# EAGLE schematic durtest4 (EAGLE 6.0)
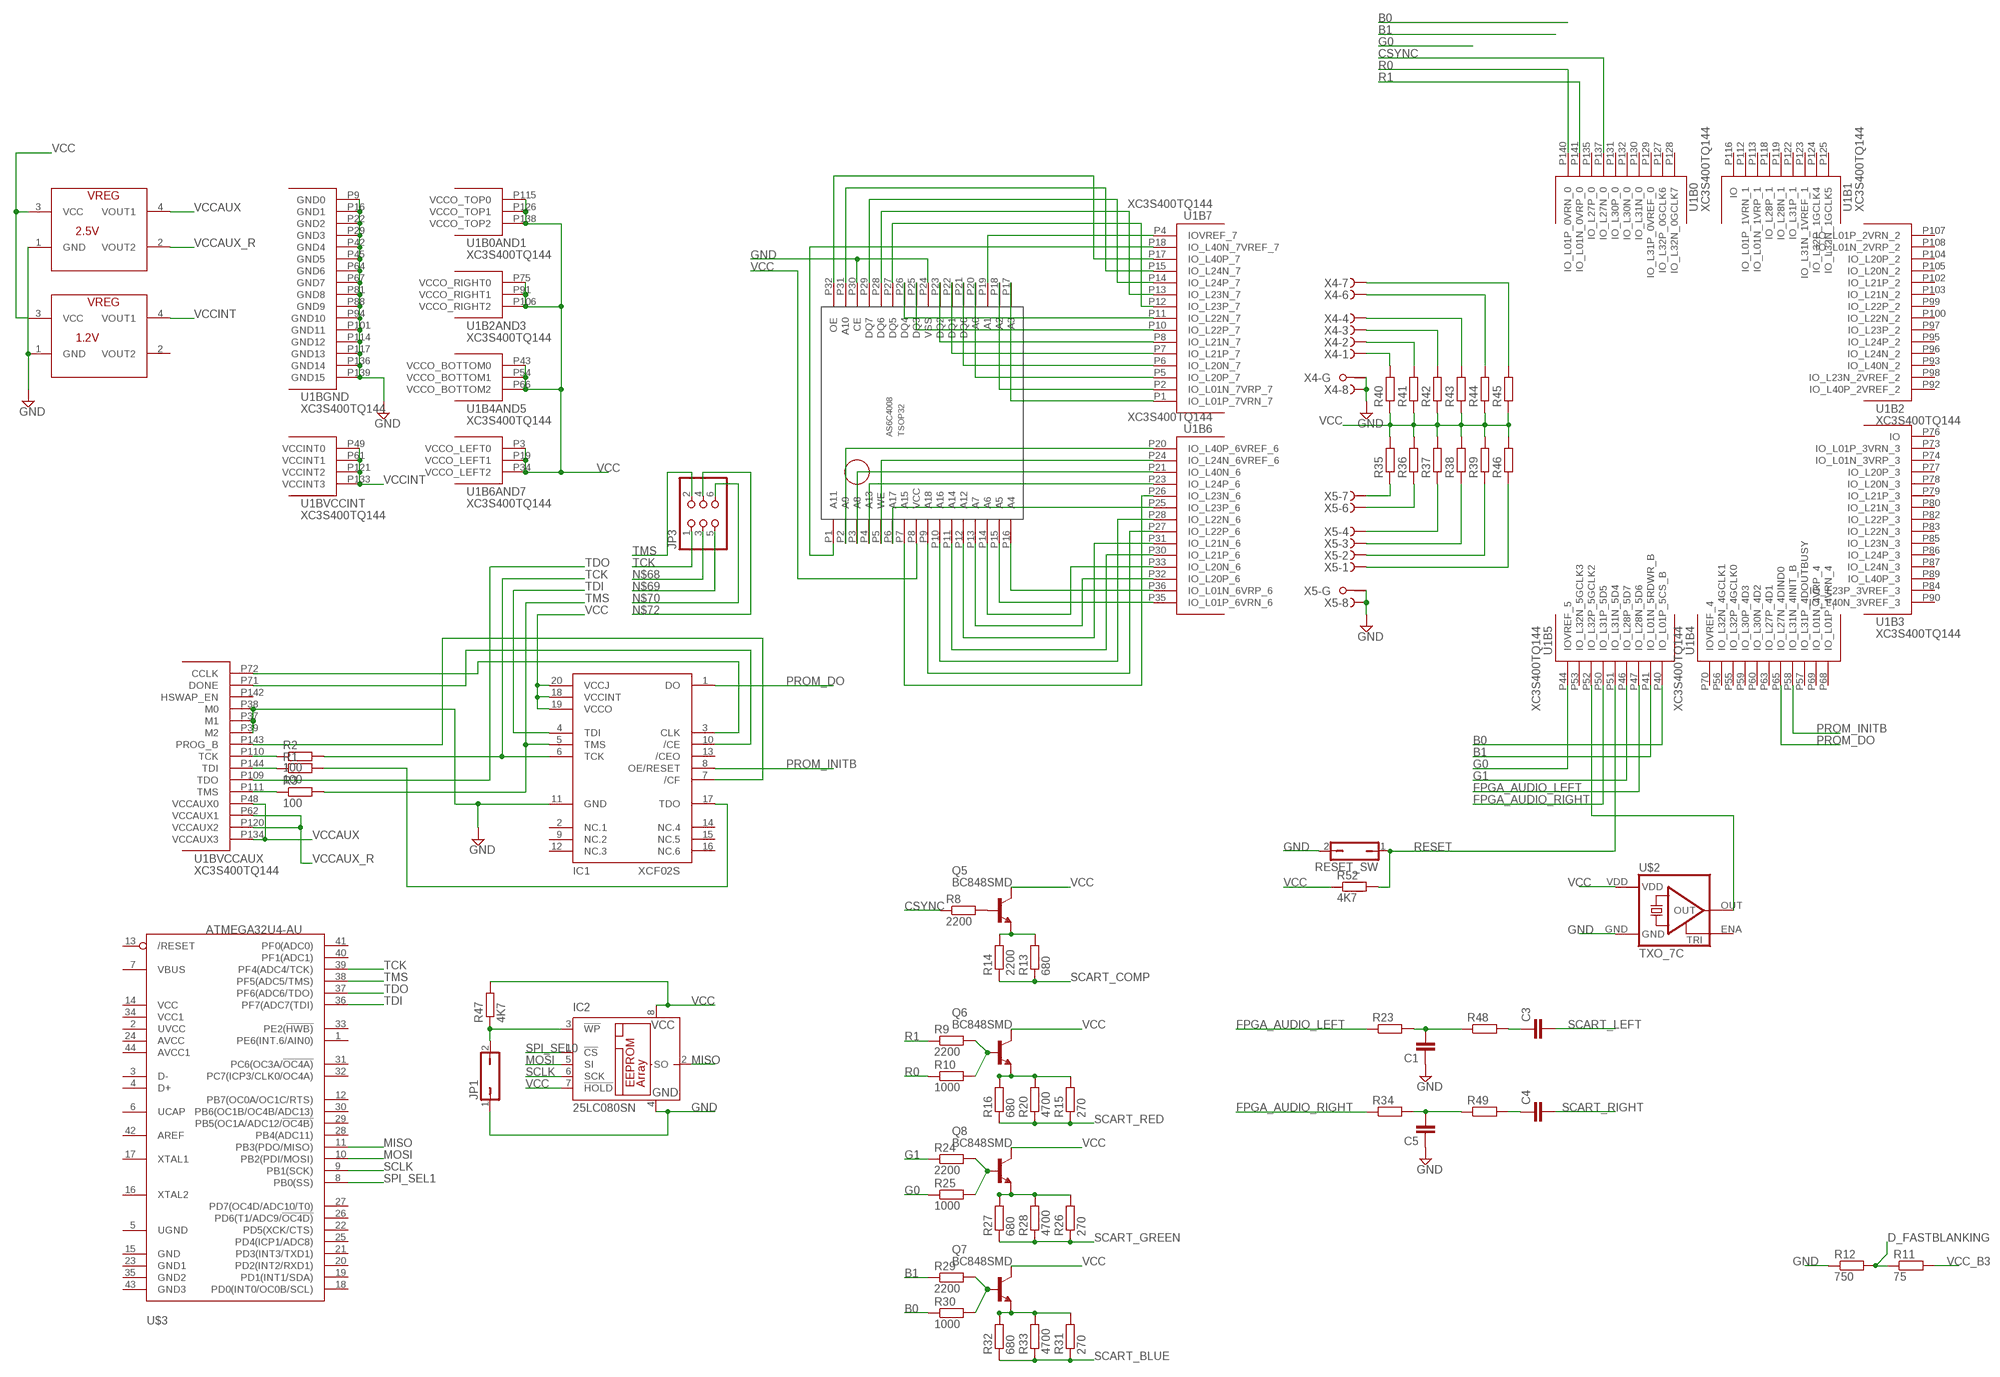
[diagram p0: schematic, sheet 1, part 1 of 2]
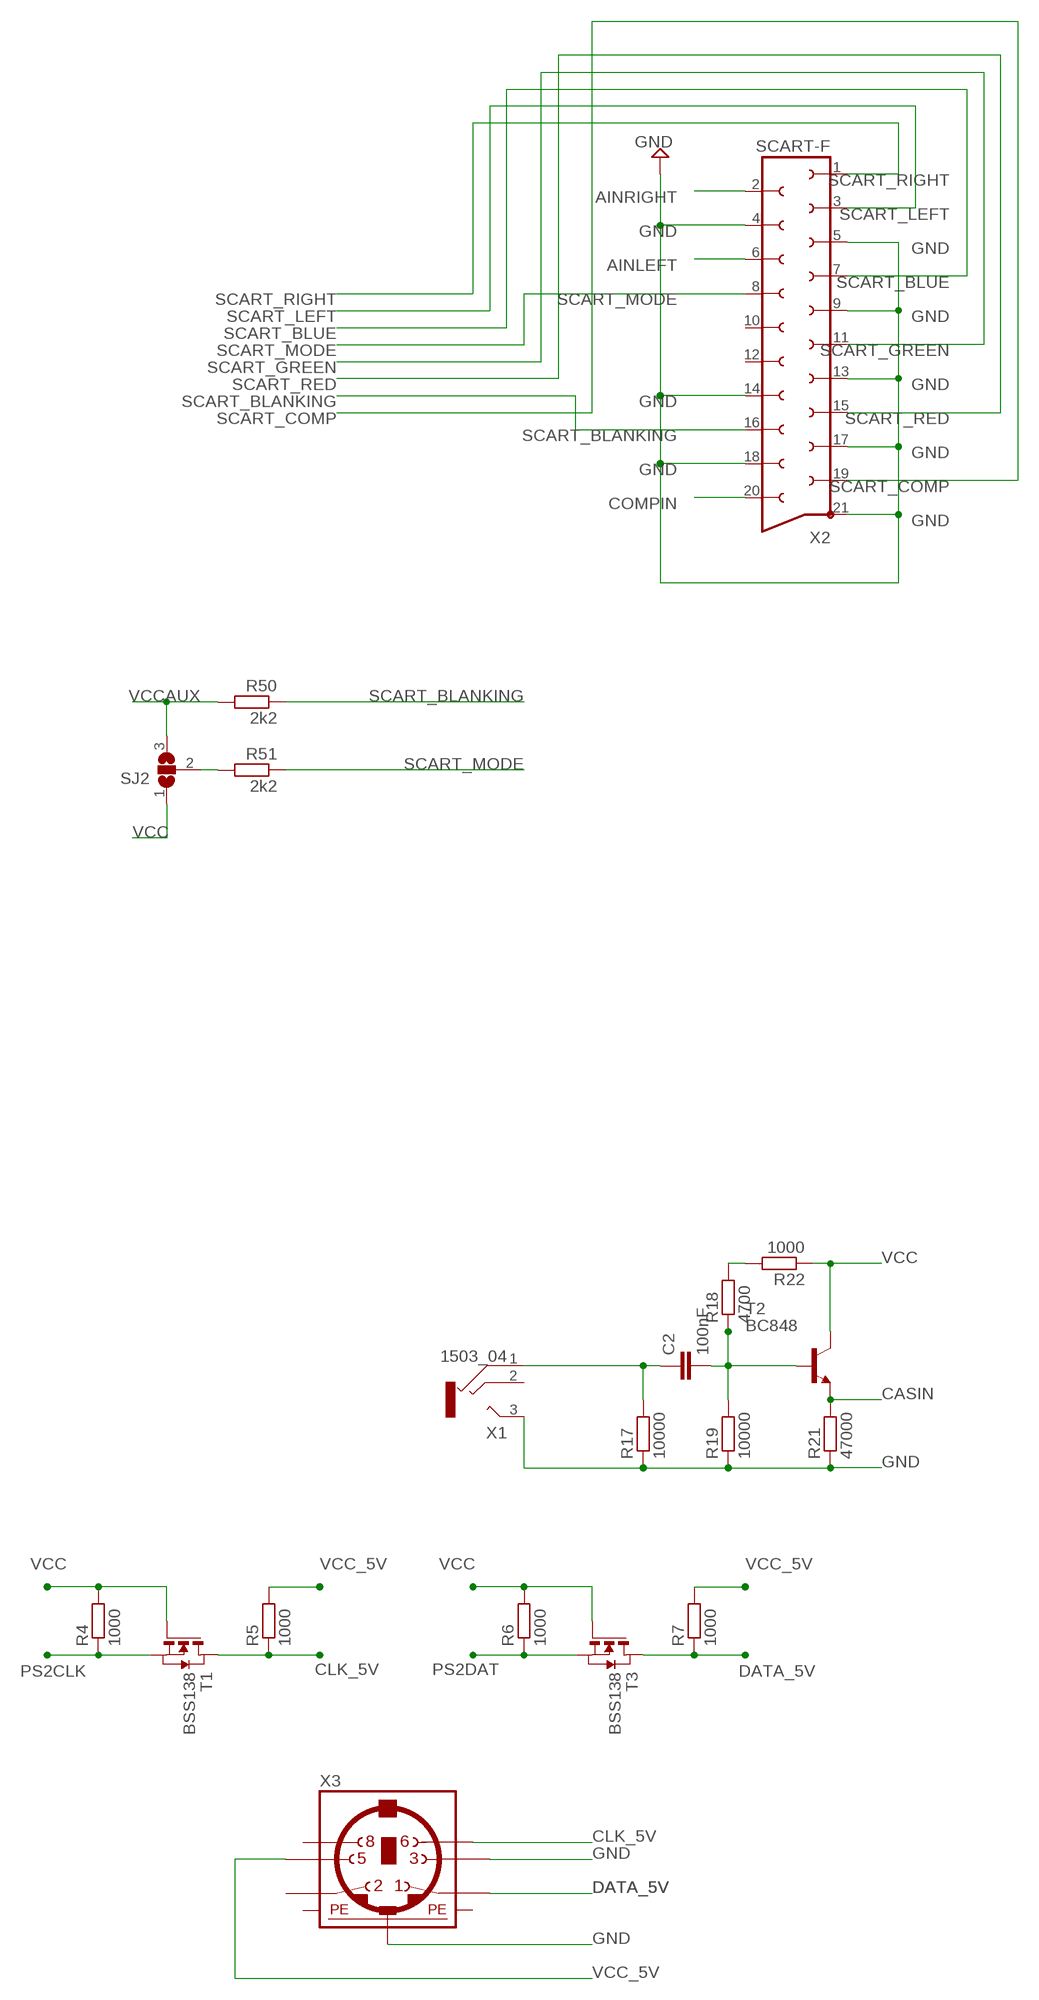
[diagram p1: schematic, sheet 1, part 2 of 2]

## Parts
C1  C-EUC0603  [C0603]
C2  100nF  C-EUC0603  [C0603]
C3  C-EUC0603  [C0603]
C4  C-EUC0603  [C0603]
C5  C-EUC0603  [C0603]
IC1  XCF02S  [VO20]
IC2  25LC080SN  [SO-08]
JP1  JP1Q  [JP1]
JP3  PINHD-2X3  [2X03]
Q5  BC848SMD  [SOT23]
Q6  BC848SMD  [SOT23]
Q7  BC848SMD  [SOT23]
Q8  BC848SMD  [SOT23]
R1  100  R-EU_R0805  [R0805]
R2  100  R-EU_R0805  [R0805]
R3  100  R-EU_R0805  [R0805]
R4  1000  R-EU_R0805  [R0805]
R5  1000  R-EU_R0805  [R0805]
R6  1000  R-EU_R0805  [R0805]
R7  1000  R-EU_R0805  [R0805]
R8  2200  R-EU_R0805  [R0805]
R9  2200  R-EU_R0805  [R0805]
R10  1000  R-EU_R0805  [R0805]
R11  75  R-EU_R0805  [R0805]
R12  750  R-EU_R0805  [R0805]
R13  680  R-EU_R0805  [R0805]
R14  2200  R-EU_R0805  [R0805]
R15  270  R-EU_R0805  [R0805]
R16  680  R-EU_R0805  [R0805]
R17  10000  R-EU_R0805  [R0805]
R18  4700  R-EU_R0805  [R0805]
R19  10000  R-EU_R0805  [R0805]
R20  4700  R-EU_R0805  [R0805]
R21  47000  R-EU_R0805  [R0805]
R22  1000  R-EU_R0805  [R0805]
R23  R-EU_M0805  [M0805]
R24  2200  R-EU_R0805  [R0805]
R25  1000  R-EU_R0805  [R0805]
R26  270  R-EU_R0805  [R0805]
R27  680  R-EU_R0805  [R0805]
R28  4700  R-EU_R0805  [R0805]
R29  2200  R-EU_R0805  [R0805]
R30  1000  R-EU_R0805  [R0805]
R31  270  R-EU_R0805  [R0805]
R32  680  R-EU_R0805  [R0805]
R33  4700  R-EU_R0805  [R0805]
R34  R-EU_M0805  [M0805]
R35  R-EU_M0805  [M0805]
R36  R-EU_M0805  [M0805]
R37  R-EU_M0805  [M0805]
R38  R-EU_M0805  [M0805]
R39  R-EU_M0805  [M0805]
R40  R-EU_M0805  [M0805]
R41  R-EU_M0805  [M0805]
R42  R-EU_M0805  [M0805]
R43  R-EU_M0805  [M0805]
R44  R-EU_M0805  [M0805]
R45  R-EU_M0805  [M0805]
R46  R-EU_M0805  [M0805]
R47  4K7  R-EU_R0805  [R0805]
R48  R-EU_M0805  [M0805]
R49  R-EU_M0805  [M0805]
R50  2k2  R-EU_M0805  [M0805]
R51  2k2  R-EU_M0805  [M0805]
R52  4K7  R-EU_M0805  [M0805]
REG1.2  1.2V  NX1117  [SOT223]
REG2.5  2.5V  NX1117  [SOT223]
RESET_SW  JP1Q  [JP1]
SJ2  SJ2W  [SJ_2]
T1  BSS138  NMOSSOT23  [SOT-23]
T2  BC848  [SOT23]
T3  BSS138  NMOSSOT23  [SOT-23]
U1  XC3S400TQ144  [TQ144]
U$1  AS6C4008  [TSOP32]
U$2  TXO_7C  [OSC_7C]
U$3  ATMEGA32U4-AU  [TQFP44]
X1  1503_04  [1503_04]
X2  SCART-F  [SCART-F]
X3  MINI_DIN_6  [M_DIN6]
X4  F09HPS  [F09HP]
X5  F09HPS  [F09HP]

## Nets
AINLEFT: X2.6
AINRIGHT: X2.2
B0: R30.1 U1.P40(B5:IO_L01P_5CS_B)
B1: R29.1 U1.P41(B5:IO_L01N_5RDWR_B)
CASIN: R21.2 T2.2(E)
CLK_5V: R5.1 T1.1(D) X3.6
COMPIN: X2.20
CSYNC: R8.1 U1.P137(B0:IO_L27N_0)
D_FASTBLANKING: R11.1 R12.2
DATA_5V: R7.1 T3.1(D) X3.1
FPGA_AUDIO_LEFT: R23.1 U1.P47(B5:IO_L28N_5D6)
FPGA_AUDIO_RIGHT: R34.1 U1.P50(B5:IO_L31P_5D5)
G0: R25.1 U1.P44(B5:IOVREF_5)
G1: R24.1 U1.P46(B5:IO_L28P_5D7)
GND: C1.1 C5.1 IC1.11(GND) IC2.4(GND) JP1.1 R12.1 R17.1 R19.1 R21.1 REG1.2.1(GND) REG2.5.1(GND) RESET_SW.2 U1.P9(BGND:GND0) U1.P16(BGND:GND1) U1.P22(BGND:GND2) U1.P29(BGND:GND3) U1.P37(BVCCAUX:M1) U1.P38(BVCCAUX:M0) U1.P39(BVCCAUX:M2) U1.P42(BGND:GND4) U1.P45(BGND:GND5) U1.P64(BGND:GND6) U1.P67(BGND:GND7) U1.P81(BGND:GND8) U1.P88(BGND:GND9) U1.P94(BGND:GND10) U1.P101(BGND:GND11) U1.P114(BGND:GND12) U1.P117(BGND:GND13) U1.P136(BGND:GND14) U1.P139(BGND:GND15) U$1.P24(VSS) U$1.P30(CE) U$2.GND X1.3 X2.4 X2.5 X2.9 X2.13 X2.14 X2.17 X2.18 X2.21 X3.3 X3.SH2(PE2) X4.8(-8:F) X4.G1(-G:G1) X5.8(-8:F) X5.G1(-G:G1)
MISO: IC2.2(SO) U$3.11(PB3(PDO/MISO))
MOSI: IC2.5(SI) U$3.10(PB2(PDI/MOSI))
N$1: U1.P1(B7:IO_L01P_7VRN_7) U$1.P17(A3)
N$2: U1.P2(B7:IO_L01N_7VRP_7) U$1.P18(A2)
N$3: U1.P4(B7:IOVREF_7) U$1.P19(A1)
N$4: U1.P5(B7:IO_L20P_7) U$1.P20(A0)
N$5: U1.P6(B7:IO_L20N_7) U$1.P21(DQ0)
N$6: U1.P7(B7:IO_L21P_7) U$1.P22(DQ1)
N$7: U1.P8(B7:IO_L21N_7) U$1.P23(DQ2)
N$8: U1.P10(B7:IO_L22P_7) U$1.P25(DQ3)
N$9: U1.P11(B7:IO_L22N_7) U$1.P26(DQ4)
N$10: U1.P12(B7:IO_L23P_7) U$1.P27(DQ5)
N$11: U1.P13(B7:IO_L23N_7) U$1.P28(DQ6)
N$12: U1.P14(B7:IO_L24P_7) U$1.P29(DQ7)
N$13: U1.P15(B7:IO_L24N_7) U$1.P31(A10)
N$14: U1.P17(B7:IO_L40P_7) U$1.P32(OE)
N$15: U1.P18(B7:IO_L40N_7VREF_7) U$1.P1(A11)
N$16: U1.P20(B6:IO_L40P_6VREF_6) U$1.P2(A9)
N$17: U1.P21(B6:IO_L40N_6) U$1.P3(A8)
N$18: U1.P23(B6:IO_L24P_6) U$1.P4(A13)
N$19: U1.P24(B6:IO_L24N_6VREF_6) U$1.P5(WE)
N$20: U1.P25(B6:IO_L23P_6) U$1.P6(A17)
N$21: U1.P26(B6:IO_L23N_6) U$1.P7(A15)
N$22: U1.P27(B6:IO_L22P_6) U$1.P9(A18)
N$23: U1.P28(B6:IO_L22N_6) U$1.P10(A16)
N$24: U1.P30(B6:IO_L21P_6) U$1.P11(A14)
N$25: U1.P31(B6:IO_L21N_6) U$1.P12(A12)
N$26: U1.P32(B6:IO_L20P_6) U$1.P13(A7)
N$27: U1.P33(B6:IO_L20N_6) U$1.P14(A6)
N$28: U1.P35(B6:IO_L01P_6VRN_6) U$1.P15(A5)
N$29: U1.P36(B6:IO_L01N_6VRP_6) U$1.P16(A4)
N$30: R35.1 X5.7(-7:F)
N$31: R36.1 X5.6(-6:F)
N$32: R37.1 X5.4(-4:F)
N$33: R38.1 X5.3(-3:F)
N$34: R39.1 X5.2(-2:F)
N$35: IC1.3(CLK) U1.P72(BVCCAUX:CCLK)
N$36: IC1.17(TDO) R1.2
N$37: R46.1 X5.1(-1:F)
N$38: IC1.10(/CE) U1.P71(BVCCAUX:DONE)
N$39: R2.1 U1.P110(BVCCAUX:TCK)
N$40: IC1.7(/CF) U1.P143(BVCCAUX:PROG_B)
N$41: R40.2 X4.1(-1:F)
N$42: R1.1 U1.P144(BVCCAUX:TDI)
N$43: R3.1 U1.P111(BVCCAUX:TMS)
N$44: R41.2 X4.2(-2:F)
N$45: R42.2 X4.3(-3:F)
N$46: R43.2 X4.4(-4:F)
N$47: R44.2 X4.6(-6:F)
N$48: R45.2 X4.7(-7:F)
N$49: IC2.3(!WP) JP1.2 R47.1
N$50: U1.P52(B5:IO_L32P_5GCLK2) U$2.OUT
N$51: C1.2 R23.2 R48.1
N$52: C3.1 R48.2
N$53: Q6.1(B) R9.2 R10.2
N$54: Q6.2(E) R15.2 R16.2 R20.2
N$55: Q8.1(B) R24.2 R25.2
N$56: Q8.2(E) R26.2 R27.2 R28.2
N$57: Q7.1(B) R29.2 R30.2
N$58: Q7.2(E) R31.2 R32.2 R33.2
N$59: Q5.2(E) R13.2 R14.2
N$60: C2.2 R18.1 R19.2 T2.1(B)
N$61: C2.1 R17.2 X1.1
N$62: R18.2 R22.2
N$63: Q5.1(B) R8.2
N$64: C4.1 R49.2
N$65: C5.2 R34.2 R49.1
N$66: R51.2 SJ2.2
N$68: JP3.3
N$69: JP3.5
N$70: JP3.6
N$72: JP3.4
PROM_DO: IC1.1(DO) U1.P65(B4:IO_L27N_4DIND0)
PROM_INITB: IC1.8(OE/RESET) U1.P58(B4:IO_L31N_4INIT_B)
PS2CLK: R4.1 T1.2(S)
PS2DAT: R6.1 T3.2(S)
R0: R10.1 U1.P140(B0:IO_L01P_0VRN_0)
R1: R9.1 U1.P141(B0:IO_L01N_0VRP_0)
RESET: R52.2 RESET_SW.1 U1.P51(B5:IO_L31N_5D4)
SCART_BLANKING: R50.1 X2.16
SCART_BLUE: R31.1 R32.1 R33.1 X2.7
SCART_COMP: R13.1 R14.1 X2.19
SCART_GREEN: R26.1 R27.1 R28.1 X2.11
SCART_LEFT: C3.2 X2.3
SCART_MODE: R51.1 X2.8
SCART_RED: R15.1 R16.1 R20.1 X2.15
SCART_RIGHT: C4.2 X2.1
SCLK: IC2.6(SCK) U$3.9(PB1(SCK))
SPI_SEL0: IC2.1(!CS)
SPI_SEL1: U$3.8(PB0(SS))
TCK: IC1.6(TCK) JP3.1 R2.2 U$3.39(PF4(ADC4/TCK))
TDI: IC1.4(TDI) U$3.36(PF7(ADC7(TDI))
TDO: U1.P109(BVCCAUX:TDO) U$3.37(PF6(ADC6/TDO))
TMS: IC1.5(TMS) JP3.2 R3.2 U$3.38(PF5(ADC5/TMS))
VCC: IC1.18(VCCINT) IC1.19(VCCO) IC1.20(VCCJ) IC2.7(!HOLD) IC2.8(VCC) Q5.3(C) Q6.3(C) Q7.3(C) Q8.3(C) R4.2 R6.2 R22.1 R35.2 R36.2 R37.2 R38.2 R39.2 R40.1 R41.1 R42.1 R43.1 R44.1 R45.1 R46.2 R47.2 R52.1 REG1.2.3(VCC) REG2.5.3(VCC) SJ2.1 T1.3(G) T2.3(C) T3.3(G) U1.P3(B6AND7:VCCO_LEFT0) U1.P19(B6AND7:VCCO_LEFT1) U1.P34(B6AND7:VCCO_LEFT2) U1.P43(B4AND5:VCCO_BOTTOM0) U1.P54(B4AND5:VCCO_BOTTOM1) U1.P66(B4AND5:VCCO_BOTTOM2) U1.P75(B2AND3:VCCO_RIGHT0) U1.P91(B2AND3:VCCO_RIGHT1) U1.P106(B2AND3:VCCO_RIGHT2) U1.P115(B0AND1:VCCO_TOP0) U1.P126(B0AND1:VCCO_TOP1) U1.P138(B0AND1:VCCO_TOP2) U$1.P8(VCC) U$2.VDD
VCC_5V: R5.2 R7.2 X3.5
VCC_B3: R11.2
VCCAUX: R50.2 REG2.5.4(VOUT1) SJ2.3 U1.P48(BVCCAUX:VCCAUX0) U1.P134(BVCCAUX:VCCAUX3)
VCCAUX_R: REG2.5.2(VOUT2) U1.P62(BVCCAUX:VCCAUX1) U1.P120(BVCCAUX:VCCAUX2)
VCCINT: REG1.2.4(VOUT1) U1.P49(BVCCINT:VCCINT0) U1.P61(BVCCINT:VCCINT1) U1.P121(BVCCINT:VCCINT2) U1.P133(BVCCINT:VCCINT3)
Unconnected: IC1.2(NC.1) IC1.9(NC.2) IC1.12(NC.3) IC1.13(/CEO) IC1.14(NC.4) IC1.15(NC.5) IC1.16(NC.6) REG1.2.2(VOUT2) U1.P53(B5:IO_L32N_5GCLK3) U1.P55(B4:IO_L32P_4GCLK0) U1.P56(B4:IO_L32N_4GCLK1) U1.P57(B4:IO_L31P_4DOUTBUSY) U1.P59(B4:IO_L30P_4D3) U1.P60(B4:IO_L30N_4D2) U1.P63(B4:IO_L27P_4D1) U1.P68(B4:IO_L01P_4VRN_4) U1.P69(B4:IO_L01N_4VRP_4) U1.P70(B4:IOVREF_4) U1.P73(B3:IO_L01P_3VRN_3) U1.P74(B3:IO_L01N_3VRP_3) U1.P76(B3:IO) U1.P77(B3:IO_L20P_3) U1.P78(B3:IO_L20N_3) U1.P79(B3:IO_L21P_3) U1.P80(B3:IO_L21N_3) U1.P82(B3:IO_L22P_3) U1.P83(B3:IO_L22N_3) U1.P84(B3:IO_L23P_3VREF_3) U1.P85(B3:IO_L23N_3) U1.P86(B3:IO_L24P_3) U1.P87(B3:IO_L24N_3) U1.P89(B3:IO_L40P_3) U1.P90(B3:IO_L40N_3VREF_3) U1.P92(B2:IO_L40P_2VREF_2) U1.P93(B2:IO_L40N_2) U1.P95(B2:IO_L24P_2) U1.P96(B2:IO_L24N_2) U1.P97(B2:IO_L23P_2) U1.P98(B2:IO_L23N_2VREF_2) U1.P99(B2:IO_L22P_2) U1.P100(B2:IO_L22N_2) U1.P102(B2:IO_L21P_2) U1.P103(B2:IO_L21N_2) U1.P104(B2:IO_L20P_2) U1.P105(B2:IO_L20N_2) U1.P107(B2:IO_L01P_2VRN_2) U1.P108(B2:IO_L01N_2VRP_2) U1.P112(B1:IO_L01P_1VRN_1) U1.P113(B1:IO_L01N_1VRP_1) U1.P116(B1:IO) U1.P118(B1:IO_L28P_1) U1.P119(B1:IO_L28N_1) U1.P122(B1:IO_L31P_1) U1.P123(B1:IO_L31N_1VREF_1) U1.P124(B1:IO_L32P_1GCLK4) U1.P125(B1:IO_L32N_1GCLK5) U1.P127(B0:IO_L32P_0GCLK6) U1.P128(B0:IO_L32N_0GCLK7) U1.P129(B0:IO_L31P_0VREF_0) U1.P130(B0:IO_L31N_0) U1.P131(B0:IO_L30P_0) U1.P132(B0:IO_L30N_0) U1.P135(B0:IO_L27P_0) U1.P142(BVCCAUX:HSWAP_EN) U$2.ENA(TRI) U$3.1(PE6(INT.6/AIN0)) U$3.2(UVCC) U$3.3(D-) U$3.4(D+) U$3.5(UGND) U$3.6(UCAP) U$3.7(VBUS) U$3.12(PB7(OC0A/OC1C/RTS)) U$3.13(/RESET) U$3.14(VCC) U$3.15(GND) U$3.16(XTAL2) U$3.17(XTAL1) U$3.18(PD0(INT0/OC0B/SCL)) U$3.19(PD1(INT1/SDA)) U$3.20(PD2(INT2/RXD1)) U$3.21(PD3(INT3/TXD1)) U$3.22(PD5(XCK/CTS)) U$3.23(GND1) U$3.24(AVCC) U$3.25(PD4(ICP1/ADC8)) U$3.26(PD6(T1/ADC9/!OC4D)) U$3.27(PD7(OC4D/ADC10/T0)) U$3.28(PB4(ADC11)) U$3.29(PB5(OC1A/ADC12/!OC4B)) U$3.30(PB6(OC1B/OC4B/ADC13)) U$3.31(PC6(OC3A/!OC4A)) U$3.32(PC7(ICP3/CLK0/OC4A)) U$3.33(PE2(!HWB)) U$3.34(VCC1) U$3.35(GND2) U$3.40(PF1(ADC1)) U$3.41(PF0(ADC0)) U$3.42(AREF) U$3.43(GND3) U$3.44(AVCC1) X1.2 X2.10 X2.12 X3.2 X3.8 X4.5(-5:F) X4.9(-9:F) X4.G2(-G:G2) X5.5(-5:F) X5.9(-9:F) X5.G2(-G:G2)

## Power pins joined to a net without a drawn wire
PE1: X3.SH1(PE1)
PE3: X3.SH3(PE3)

## Library data of the parts
C1-C5 = resistor:C-EU: CAPACITOR, European symbol
IC1 = smd-special:XCF02S
IC2 = microchip:25*: Serial EEPROM 4K/ 8K , SPI bus; MF: MICROCHIP; MPN: 25LC080/SN; OC_FARNELL: 1137302; OC_NEWARK: 96K4092
JP1 RESET_SW = jumper:JP1Q: JUMPER
JP3 = pinhead:PINHD-2X3: PIN HEADER
Q5-Q8 = bc548:BC848*: NPN Transistor
R1-R22 R24-R33 R47 = rcl:R-EU_: RESISTOR, European symbol
R23 R34-R46 R48-R52 = resistor:R-EU_: RESISTOR, European symbol
REG1.2 REG2.5 = cpcfpga:NX1117
SJ2 = jumper:SJ2W: SMD solder JUMPER
T1 T3 = zetex:NMOSSOT23: MOS FET; OC_FARNELL: unknown; OC_NEWARK: unknown
T2 = transistor:BC848: NPN TRANSISTOR
U1 = xilinx_spartan3_virtex4_and_5:XC3S400TQ144: Xilinx FPGA
U$1 = cpcfpga:AS6C4008
U$2 = cpcfpga:TXO_7C: TXC crystal oscillator http://www.txccrystal.com/images/pdf/7c.pdf
U$3 = adafruit:ATMEGA32U4: http://www.ladyada.net/library/eagle
X1 = con-lumberg:1503_04: Jack connectors according to JISC 6560, 3.5 mm, IP 57 Klinkensteckverbinder nach JISC 6560, 3,5 mm, IP 57 Source: http://www.lumberg.com/Produkte/PDFs/1503_04.pdf; OC_FARNELL: 1216981; OC_NEWARK: unknown
X2 = con-hirschmann:SCART-F: TV SCART CONNECTOR; OC_FARNELL: unknown; OC_NEWARK: unknown
X3 = mini_din:MINI_DIN_6
X4 X5 = con-subd:F09HPS: SUB-D; OC_FARNELL: unknown; OC_NEWARK: unknown

## Net classes
1 power: width 0.6 mm, drill 1.1 mm, clearance 0.4 mm